# Altium schematic sheet L2_Output.SchDoc
size 482 x 254 mm; SheetNumber: 1; SheetTotal: 1
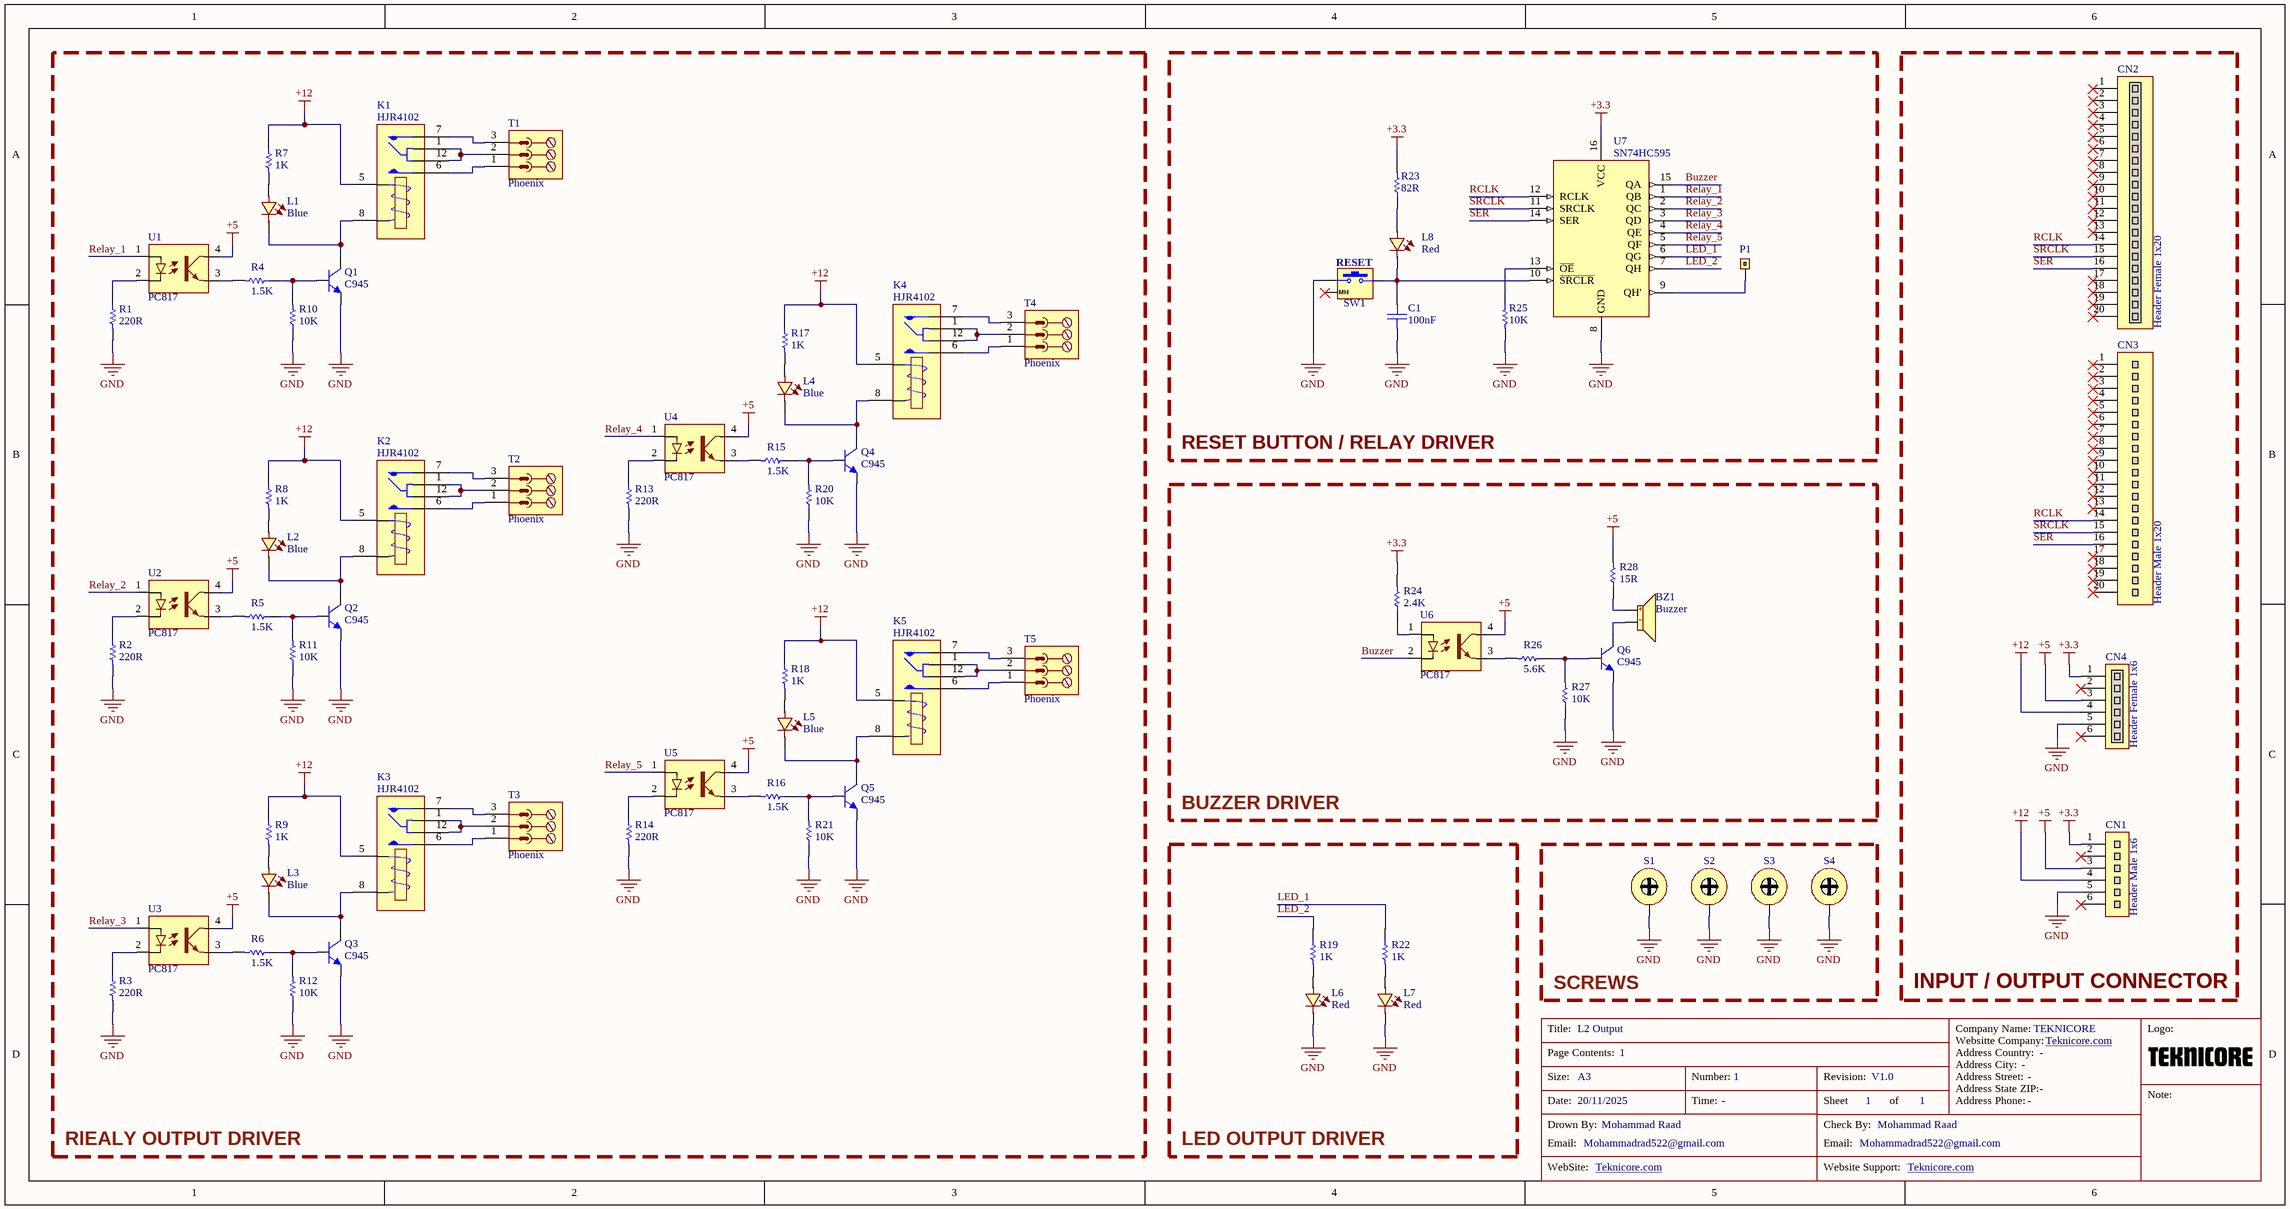
[diagram p0: L2_Output.SchDoc]

## Parts
BZ1  Buzzer  [Buzzer]
C1  100nF  [CAP1206]
CN1  Header Male 1x6  [HDR_M_1x6PIN_0.2"]
CN2  Header Female 1x20  [HDR_F_1x20PIN_0.2"]
CN3  Header Male 1x20  [HDR_M_1x20PIN_0.2"]
CN4  Header Female 1x6  [HDR_F_1x6PIN_0.2"]
K1  HJR4102  [RELAY_HJR-4102-L-05V]
K2  HJR4102  [RELAY_HJR-4102-L-05V]
K3  HJR4102  [RELAY_HJR-4102-L-05V]
K4  HJR4102  [RELAY_HJR-4102-L-05V]
K5  HJR4102  [RELAY_HJR-4102-L-05V]
L1  Blue  [LED_3mm_R]
L2  Blue  [LED_3mm_R]
L3  Blue  [LED_3mm_R]
L4  Blue  [LED_3mm_R]
L5  Blue  [LED_3mm_R]
L6  Red  [LED_3mm_R]
L7  Red  [LED_3mm_R]
L8  Red  [LED_3mm_R]
P1  Header 1x1  [HDR 1X1-2.54mm]  (value not drawn)
Q1  C945  [SOT23_M]
Q2  C945  [SOT23_M]
Q3  C945  [SOT23_M]
Q4  C945  [SOT23_M]
Q5  C945  [SOT23_M]
Q6  C945  [SOT23_M]
R1  220R  [Resistor_SMD_1206]
R2  220R  [Resistor_SMD_1206]
R3  220R  [Resistor_SMD_1206]
R4  1.5K  [Resistor_SMD_1206]
R5  1.5K  [Resistor_SMD_1206]
R6  1.5K  [Resistor_SMD_1206]
R7  1K  [Resistor_SMD_1206]
R8  1K  [Resistor_SMD_1206]
R9  1K  [Resistor_SMD_1206]
R10  10K  [Resistor_SMD_1206]
R11  10K  [Resistor_SMD_1206]
R12  10K  [Resistor_SMD_1206]
R13  220R  [Resistor_SMD_1206]
R14  220R  [Resistor_SMD_1206]
R15  1.5K  [Resistor_SMD_1206]
R16  1.5K  [Resistor_SMD_1206]
R17  1K  [Resistor_SMD_1206]
R18  1K  [Resistor_SMD_1206]
R19  1K  [Resistor_SMD_1206]
R20  10K  [Resistor_SMD_1206]
R21  10K  [Resistor_SMD_1206]
R22  1K  [Resistor_SMD_1206]
R23  82R  [Resistor_SMD_1206]
R24  2.4K  [Resistor_SMD_1206]
R25  10K  [Resistor_SMD_1206]
R26  5.6K  [Resistor_SMD_1206]
R27  10K  [Resistor_SMD_1206]
R28  15R  [Resistor_SMD_1206]
S1  Screw  [Screw 3mm-Invirons 0.254mm]  (value not drawn)
S2  Screw  [Screw 3mm-Invirons 0.254mm]  (value not drawn)
S3  Screw  [Screw 3mm-Invirons 0.254mm]  (value not drawn)
S4  Screw  [Screw 3mm-Invirons 0.254mm]  (value not drawn)
SW1  Push Button  [SW_PushBotton_Right]  (value not drawn)
T1  Phoenix  [MSTB 2,5/3-G-5,08]
T2  Phoenix  [MSTB 2,5/3-G-5,08]
T3  Phoenix  [MSTB 2,5/3-G-5,08]
T4  Phoenix  [MSTB 2,5/3-G-5,08]
T5  Phoenix  [MSTB 2,5/3-G-5,08]
T?  Title: L2 Output  Page Conteents: 1  Size: A3  Drawn By: Mohammad Raad  Drown By (Email): Mohammadrad522@gmail.com  Website: Teknicore.com  Date: 20/11/2025  Reversion: V1.0  Company Name: TEKNICORE  (hidden comment: Title Block)  (graphical)
U1  PC817  [PC817 DIP]
U2  PC817  [PC817 DIP]
U3  PC817  [PC817 DIP]
U4  PC817  [PC817 DIP]
U5  PC817  [PC817 DIP]
U6  PC817  [PC817 DIP]
U7  SN74HC595  [SOIC16]

## Blocks framed on the sheet
RlEALY OUTPUT DRIVER: K1-K5 L1-L5 Q1-Q5 R1-R18 R20 R21 T1-T5 U1-U5
RESET BUTTON / RELAY DRIVER: C1 L8 P1 R23 R25 SW1 U7
INPUT / OUTPUT CONNECTOR: CN1-CN4
BUZZER DRIVER: BZ1 Q6 R24 R26-R28 U6
LED OUTPUT DRIVER: L6 L7 R19 R22
SCREWS: S1-S4

## Nets
+3.3: CN1.1 CN4.1 R23.2 R24.2 U7.16(VCC)
+5: CN1.3 CN4.3 R28.2 U1.4 U2.4 U3.4 U4.4 U5.4 U6.4
+12: CN1.4 CN4.4 K1.5(T1) K2.5(T1) K3.5(T1) K4.5(T1) K5.5(T1) R7.1 R8.1 R9.1 R17.1 R18.1
GND: C1.1 CN1.5 CN4.5 L6.K L7.K Q1.2(E) Q2.2(E) Q3.2(E) Q4.2(E) Q5.2(E) Q6.2(E) R1.2 R2.2 R3.2 R10.1 R11.1 R12.1 R13.2 R14.2 R20.1 R21.1 R25.2 R27.1 S1.S S2.S S3.S S4.S SW1.1 U7.8(GND)
Buzzer: U6.2 U7.15(QA)
LED_1: R22.1 U7.6(QG)
LED_2: R19.1 U7.7(QH)
RCLK: CN2.14 CN3.14 U7.12(RCLK)
Relay_1: U1.1 U7.1(QB)
Relay_2: U2.1 U7.2(QC)
Relay_3: U3.1 U7.3(QD)
Relay_4: U4.1 U7.4(QE)
Relay_5: U5.1 U7.5(QF)
SER: CN2.16 CN3.16 U7.14(SER)
SRCLK: CN2.15 CN3.15 U7.11(SRCLK)
NetBZ1_1: BZ1.1 R28.1
NetBZ1_2: BZ1.2 Q6.3(C)
NetC1_2: C1.2 L8.K SW1.2 U7.10(~{SRCLR})
NetK1_1: K1.1(COM) K1.12(COM) T1.2
NetK1_6: K1.6(NO) T1.1
NetK1_7: K1.7(NC) T1.3
NetK1_8: K1.8(T2) L1.K Q1.3(C)
NetK2_1: K2.1(COM) K2.12(COM) T2.2
NetK2_6: K2.6(NO) T2.1
NetK2_7: K2.7(NC) T2.3
NetK2_8: K2.8(T2) L2.K Q2.3(C)
NetK3_1: K3.1(COM) K3.12(COM) T3.2
NetK3_6: K3.6(NO) T3.1
NetK3_7: K3.7(NC) T3.3
NetK3_8: K3.8(T2) L3.K Q3.3(C)
NetK4_1: K4.1(COM) K4.12(COM) T4.2
NetK4_6: K4.6(NO) T4.1
NetK4_7: K4.7(NC) T4.3
NetK4_8: K4.8(T2) L4.K Q4.3(C)
NetK5_1: K5.1(COM) K5.12(COM) T5.2
NetK5_6: K5.6(NO) T5.1
NetK5_7: K5.7(NC) T5.3
NetK5_8: K5.8(T2) L5.K Q5.3(C)
NetL1_A: L1.A R7.2
NetL2_A: L2.A R8.2
NetL3_A: L3.A R9.2
NetL4_A: L4.A R17.2
NetL5_A: L5.A R18.2
NetL6_A: L6.A R19.2
NetL7_A: L7.A R22.2
NetL8_A: L8.A R23.1
NetP1_1: P1.1 U7.9(QH')
NetQ1_1: Q1.1(B) R4.1 R10.2
NetQ2_1: Q2.1(B) R5.1 R11.2
NetQ3_1: Q3.1(B) R6.1 R12.2
NetQ4_1: Q4.1(B) R15.1 R20.2
NetQ5_1: Q5.1(B) R16.1 R21.2
NetQ6_1: Q6.1(B) R26.1 R27.2
NetR1_1: R1.1 U1.2
NetR2_1: R2.1 U2.2
NetR3_1: R3.1 U3.2
NetR4_2: R4.2 U1.3
NetR5_2: R5.2 U2.3
NetR6_2: R6.2 U3.3
NetR13_1: R13.1 U4.2
NetR14_1: R14.1 U5.2
NetR15_2: R15.2 U4.3
NetR16_2: R16.2 U5.3
NetR24_1: R24.1 U6.1
NetR25_1: R25.1 U7.13(~{OE})
NetR26_2: R26.2 U6.3

Not connected (* = marked no-connect by the designer): CN1 2* 6*; CN2 1* 2* 3* 4* 5* 6* 7* 8* 9* 10* 11* 12* 13* 17* 18* 19* 20*; CN3 1* 2* 3* 4* 5* 6* 7* 8* 9* 10* 11* 12* 13* 17* 18* 19* 20*; CN4 2* 6*; SW1 MH*

## Notes on the sheet
- (near SW1) RESET
- (in symbol Buzzer) +; _
- (in symbol Title Block) Title:; Company Name:; Logo:; Websitte Company:; Page Contents:; Address Country:; Address City:; Size:; Number:; Revision:; Address Street:; Address State ZIP:; Note:; Date:; Time:; Sheet; of; Address Phone:; Drown By:; Check By:; Email:; WebSite:; Website Support:

## Library data of the parts
C1 = Capacitor Poliester & Ceramic
K1-K5 = Relay_HJR4102: Small size and low cost; ComponentLink1Description: Datasheet
L1-L8 = LED
P1 = Header Male 1x1
Q1-Q6 = C945: NPN Silicon Epitaxial Planar Transistor
R1-R28 = Resistor
SW1 = Push Button 4PIN Right
T1-T5 = Terminal Phoenix 3 Pin
U1-U6 = PC817: 1-CHANNEL TRANSISTOR OUTPUT TYPE PHOTO COUPLER
U7 = SN74HC595: SNx4HC595 8-Bit Shift Registers With 3-State Output Registers
T? = Title Block: Number Sheet: 1; This Sheet Number: 1; All Sheet Number: 1; Checked By: Mohammad Raad; Checked By (Email): Mohammadrad522@gmail.com; Website Support: Teknicore.com; Website Company: Teknicore.com; Address Country: -; Address City: -; Address Country Street: -; Address State ZIP: -; Address Phone: -; Time:: -